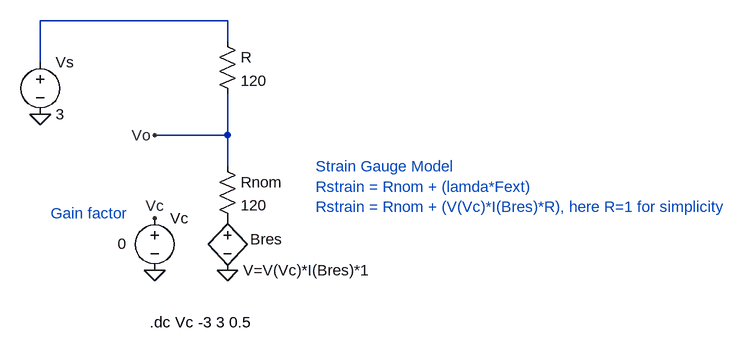
[diagram p0: schematic Lab 1 Experiment 1 - 1 Strain Gauge.asc]
Lab 1 Experiment 1 - 1 Strain Gauge.asc, the LTspice schematic file:
Version 4
SHEET 1 880 680
WIRE -32 -112 -320 -112
WIRE -32 -80 -32 -112
WIRE -320 -48 -320 -112
WIRE -32 64 -32 0
WIRE -32 64 -144 64
WIRE -32 112 -32 64
FLAG -144 272 0
FLAG -144 192 Vc
FLAG -32 272 0
FLAG -320 32 0
FLAG -144 64 Vo
SYMBOL bv -32 176 R0
WINDOW 0 35 48 Left 2
SYMATTR InstName Bres
SYMATTR Value V=V(Vc)*I(Bres)*1
SYMBOL voltage -144 176 R0
WINDOW 3 -57 55 Left 2
WINDOW 123 0 0 Left 0
WINDOW 39 0 0 Left 0
SYMATTR Value 0
SYMATTR InstName Vc
SYMBOL res -48 96 R0
SYMATTR InstName Rnom
SYMATTR Value 120
SYMBOL res -48 -96 R0
SYMATTR InstName R
SYMATTR Value 120
SYMBOL voltage -320 -64 R0
WINDOW 123 0 0 Left 0
WINDOW 39 0 0 Left 0
SYMATTR InstName Vs
SYMATTR Value 3
TEXT 104 112 Left 2 ;Strain Gauge Model\nRstrain = Rnom + (lamda*Fext)\nRstrain = Rnom + (V(Vc)*I(Bres)*R), here R=1 for simplicity
TEXT -152 352 Left 2 !.dc Vc -3 3 0.5
TEXT -304 184 Left 2 ;Gain factor

The netlist it stands for:
* Lab 1 Experiment 1 - 1 Strain Gauge.asc
Bres P001 0 V=V(Vc)*I(Bres)*1
Vc Vc 0 0
Rnom Vo P001 120
R N001 Vo 120
Vs N001 0 3
* Strain Gauge Model
* Rstrain = Rnom + (lamda*Fext)
* Rstrain = Rnom + (V(Vc)*I(Bres)*R), here R=1 for simplicity
.dc Vc -3 3 0.5
* Gain factor
.backanno
.end